# EAGLE design pcb (EAGLE 9.6.2)
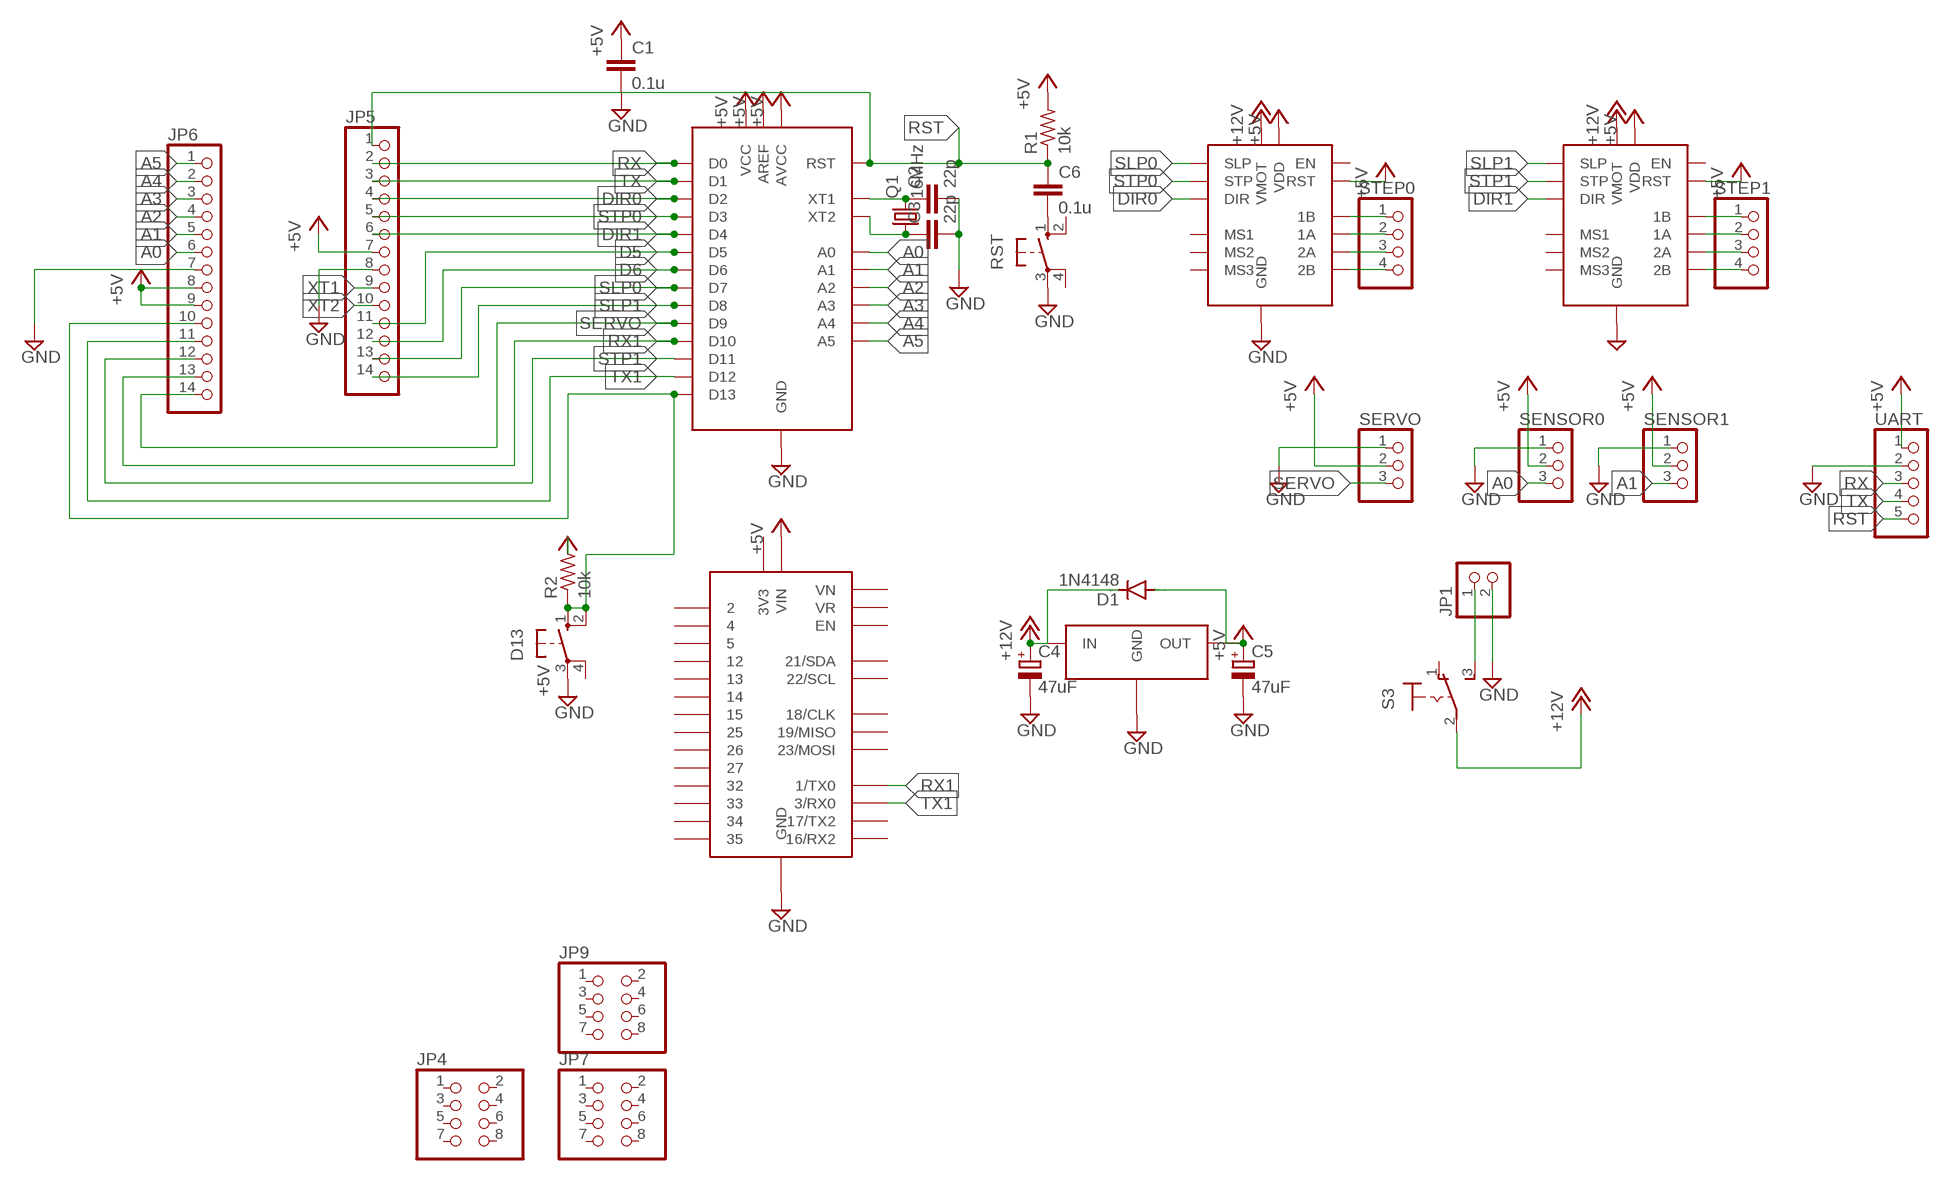
[diagram p0: schematic, sheet 1]

## Parts
C1  0.1u  C-EU025-025X050  [C025-025X050]
C2  22p  C-EU025-025X050  [C025-025X050]
C3  22p  C-EU025-025X050  [C025-025X050]
C4  47uF  CPOL-EUE2.5-5  [E2,5-5]
C5  47uF  CPOL-EUE2.5-5  [E2,5-5]
C6  0.1u  C-EU025-025X050  [C025-025X050]
D1  1N4148  [DO35-7]
D13  10-XX  [B3F-10XX]
IC1  ATMEGA328P-3  [DIL28-3]
JP1  PINHD-1X2  [1X02]
JP4  PINHD-2X4  [2X04]
JP5  PINHD-1X14  [1X14]
JP6  PINHD-1X14  [1X14]
JP7  PINHD-2X4  [2X04]
JP9  PINHD-2X4  [2X04]
Q1  16MHz  CRYSTALHC49S  [HC49/S]
R1  10k  R-US_0204/7  [0204/7]
R2  10k  R-US_0204/7  [0204/7]
RST  10-XX  [B3F-10XX]
S3  TOGGLE  [TOGGLE]
SENSOR0  PINHD-1X3  [1X03]
SENSOR1  PINHD-1X3  [1X03]
SERVO  PINHD-1X3  [1X03]
STEP0  PINHD-1X4  [1X04]
STEP1  PINHD-1X4  [1X04]
U$1  A4988  [A4988]
U$2  A4988  [A4988]
U$3  NODE32S  [NODE32S]
U$5  NJM7805  [NJM7805]
UART  PINHD-1X5  [1X05]

## Nets
+5V: C1.1 C5.+ D1.A IC1.AREF IC1.AVCC IC1.VCC JP5.7 JP6.8 JP6.9 R1.2 R2.2 SENSOR0.2 SENSOR1.2 SERVO.2 U$1.RST U$1.VDD U$2.RST U$2.VDD U$3.VIN U$5.OUT UART.1
+12V: C4.+ D1.C S3.2(P) U$1.VMOT U$2.VMOT U$5.IN
A0: IC1.A0 JP6.6 SENSOR0.3
A1: IC1.A1 JP6.5 SENSOR1.3
A2: IC1.A2 JP6.4
A3: IC1.A3 JP6.3
A4: IC1.A4 JP6.2
A5: IC1.A5 JP6.1
D5: IC1.D5 JP5.11
D6: IC1.D6 JP5.12
DIR0: IC1.D2 JP5.4 U$1.DIR
DIR1: IC1.D4 JP5.6 U$2.DIR
GND: C1.2 C2.2 C3.2 C4.- C5.- D13.3(P) IC1.GND1(GND) IC1.GND2(GND) JP1.2 JP5.8 JP6.7 RST.3(P) SENSOR0.1 SENSOR1.1 SERVO.1 U$1.GND0(GND) U$1.GND1(GND) U$2.GND0(GND) U$2.GND1(GND) U$3.GND U$3.GND1(GND) U$5.GND UART.2
N$1: STEP0.1 U$1.1B
N$2: STEP0.2 U$1.1A
N$3: STEP0.3 U$1.2A
N$4: STEP0.4 U$1.2B
N$5: C6.2 RST.1(S)
N$8: D13.1(S) D13.2(S1) IC1.D13 JP6.10 R2.1
N$9: STEP1.1 U$2.1B
N$10: STEP1.2 U$2.1A
N$11: STEP1.3 U$2.2A
N$12: STEP1.4 U$2.2B
N$13: JP1.1 S3.3(S)
RST: C6.1 IC1.RST JP5.1 R1.1 UART.5
RX: IC1.D0 JP5.2 UART.3
RX1: IC1.D10 JP6.13 U$3.TX0(1/TX0)
SERVO: IC1.D9 JP6.14 SERVO.3
SLP0: IC1.D7 JP5.13 U$1.SLP
SLP1: IC1.D8 JP5.14 U$2.SLP
STP0: IC1.D3 JP5.5 U$1.STP
STP1: IC1.D11 JP6.12 U$2.STP
TX: IC1.D1 JP5.3 UART.4
TX1: IC1.D12 JP6.11 U$3.RX0(3/RX0)
XT1: C2.1 IC1.XT1 JP5.9 Q1.2
XT2: C3.1 IC1.XT2 JP5.10 Q1.1
Unconnected: D13.4(P1) JP4.1 JP4.2 JP4.3 JP4.4 JP4.5 JP4.6 JP4.7 JP4.8 JP7.1 JP7.2 JP7.3 JP7.4 JP7.5 JP7.6 JP7.7 JP7.8 JP9.1 JP9.2 JP9.3 JP9.4 JP9.5 JP9.6 JP9.7 JP9.8 RST.2(S1) RST.4(P1) S3.1(O) U$1.EN U$1.MS1 U$1.MS2 U$1.MS3 U$2.EN U$2.MS1 U$2.MS2 U$2.MS3 U$3.2 U$3.3V3 U$3.4 U$3.5 U$3.12 U$3.13 U$3.14 U$3.15 U$3.18(18/CLK) U$3.19(19/MISO) U$3.21(21/SDA) U$3.25 U$3.26 U$3.27 U$3.32 U$3.33 U$3.34 U$3.35 U$3.D22(22/SCL) U$3.D23(23/MOSI) U$3.EN U$3.RX2(16/RX2) U$3.TX2(17/TX2) U$3.VN U$3.VR

## Library data of the parts
C1-C3 C6 = rcl:C-EU: CAPACITOR, European symbol; SPICEPREFIX: C
C4 C5 = rcl:CPOL-EU: POLARIZED CAPACITOR, European symbol; SPICEPREFIX: C
D1 = 00_Mylibrary:1N4148: DIODE high speed (Philips)
D13 RST = switch-omron:10-XX: OMRON SWITCH; MPN: B3F-1000; OC_FARNELL: 176432; OC_NEWARK: 36M3542
IC1 = 00_Mylibrary:ATMEGA328P: Dual In Line
JP1 = 00_connectors:PINHD-1X2: PIN HEADER
JP4 JP7 JP9 = 00_connectors:PINHD-2X4: PIN HEADER
JP5 JP6 = pinhead:PINHD-1X14: PIN HEADER
Q1 = crystal:CRYSTAL: CRYSTAL; OC_FARNELL: 1667008; OC_NEWARK: unknown
R1 R2 = rcl:R-US_: RESISTOR, American symbol; SPICEPREFIX: R
S3 = 00_Mylibrary:TOGGLE: TOGGLE SWITCH distributor RS Components
SENSOR0 SENSOR1 SERVO = 00_connectors:PINHD-1X3: PIN HEADER
STEP0 STEP1 = 00_connectors:PINHD-1X4: PIN HEADER
U$1 U$2 = 00_Mylibrary:A4988
U$3 = 00_Mylibrary:NODE32S
U$5 = 00_Mylibrary:NJM7805
UART = 00_connectors:PINHD-1X5: PIN HEADER

## Net classes
0 default: width 1.2 mm, clearance 0.4 mm

## Board
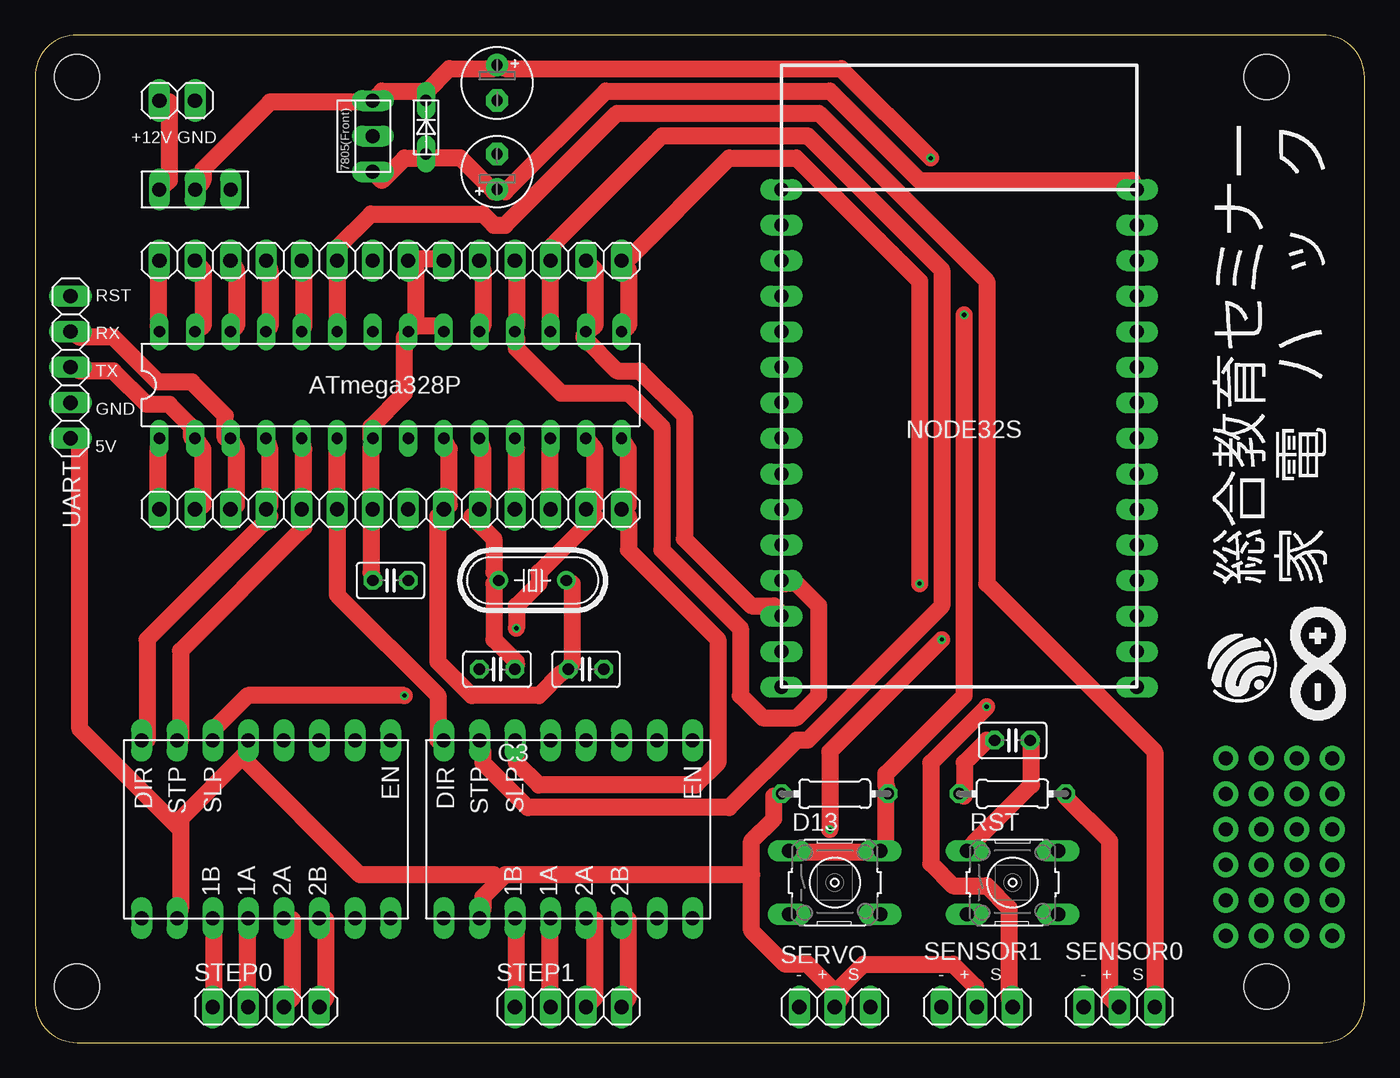
[diagram p1: board, top side]
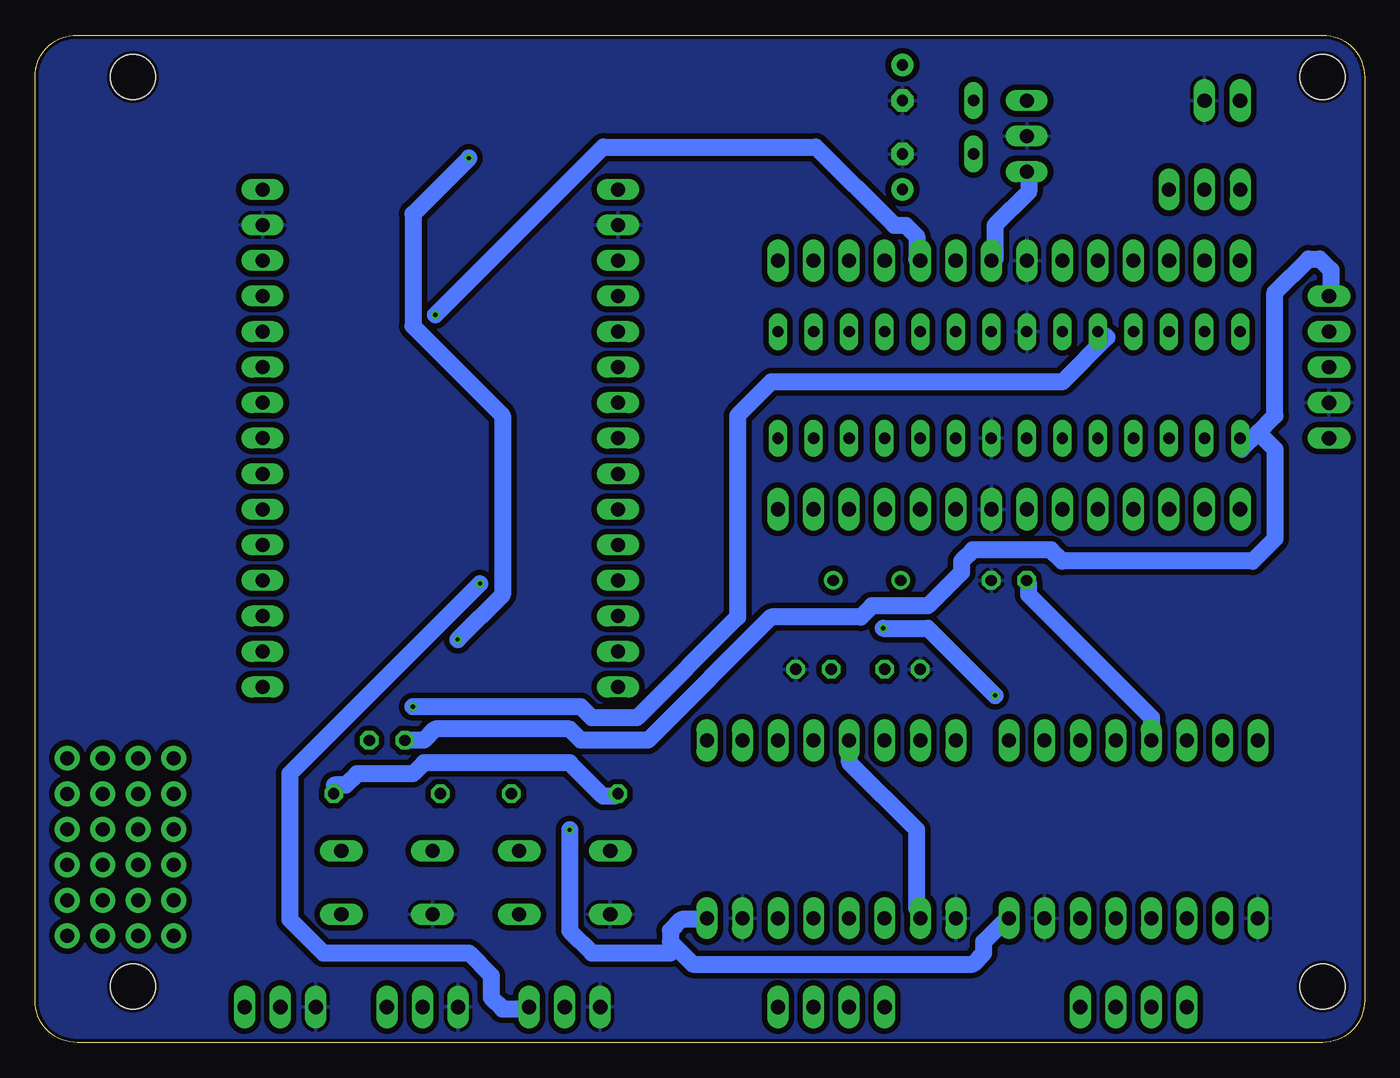
[diagram p2: board, bottom side, seen from below]

Size 95 x 72 mm. Coordinates in mm from the lower left corner, seen from the top.
Outline: 0,69 0,3 arc90 3,0 92,0 arc90 95,3 95,69 arc90 92,72 3,72 arc90 0,69
Copper layers (1*16): Top 0.035mm / dielectric 1.5mm / Bottom 0.035mm
Design rules "SeeedStudio_2layer_DRU_no_angle_20140221": minimum track width 6mil, minimum drill 12mil, track to track 6mil, track to pad 6mil, pad to pad 6mil, via to via 6mil, smd to smd 0mil, copper to edge 10mil, drill to drill 10mil, minimum pad ring 10mil, minimum via ring 6mil, stop-mask expansion 2mil, vias tented up to drill 100mil, thermal gap 10mil
Holes 3.2 mm at 3,69 3,4 88,4 88,69

### Footprints (pad centres in the part's own frame; a part is rotated, then mirrored left to right if it is on the bottom)
C025-025X050 = drill 0.813 octagon: 1 -1.27,0; 2 1.27,0
E2,5-5 = drill 0.813 pad 1.6: + -1.27,0 | drill 0.813 pad 1.6 octagon: - 1.27,0
DO35-7 = drill 0.813 long: A 3.81,0; C 0,0
B3F-10XX = drill 1.016 long: 1 -3.251,2.261; 2 3.251,2.261; 3 -3.251,-2.261; 4 3.251,-2.261
DIL28-3 = drill 0.813 long: A0 -3.81,3.81; A1 -6.35,3.81; A2 -8.89,3.81; A3 -11.43,3.81; A4 -13.97,3.81; A5 -16.51,3.81; AREF 1.27,3.81; AVCC 3.81,3.81; D0 -13.97,-3.81; D1 -11.43,-3.81; D2 -8.89,-3.81; D3 -6.35,-3.81; D4 -3.81,-3.81; D5 8.89,-3.81; D6 11.43,-3.81; D7 13.97,-3.81; D8 16.51,-3.81; D9 16.51,3.81; D10 13.97,3.81; D11 11.43,3.81; D12 8.89,3.81; D13 6.35,3.81; GND1 1.27,-3.81; GND2 -1.27,3.81; RST -16.51,-3.81; VCC -1.27,-3.81; XT1 3.81,-3.81; XT2 6.35,-3.81
1X02 = drill 1.016 long: 1 -1.27,0; 2 1.27,0
2X04 = drill 1 pad 1.778: 1 -3.81,-1.27; 2 -3.81,1.27; 3 -1.27,-1.27; 4 -1.27,1.27; 5 1.27,-1.27; 6 1.27,1.27; 7 3.81,-1.27; 8 3.81,1.27
1X14 = drill 1.016 long: 1 -16.51,0; 2 -13.97,0; 3 -11.43,0; 4 -8.89,0; 5 -6.35,0; 6 -3.81,0; 7 -1.27,0; 8 1.27,0; 9 3.81,0; 10 6.35,0; 11 8.89,0; 12 11.43,0; 13 13.97,0; 14 16.51,0
HC49/S = drill 0.813: 1 -2.413,0; 2 2.413,0
0204/7 = drill 0.813 octagon: 1 -3.81,0; 2 3.81,0
TOGGLE = drill 1 long: 1 0,2.54; 2 0,0; 3 0,-2.54
1X03 = drill 1.016 long: 1 -2.54,0; 2 0,0; 3 2.54,0
1X04 = drill 1.016 long: 1 -3.81,0; 2 -1.27,0; 3 1.27,0; 4 3.81,0
A4988 = drill 1 long: 1A 6.35,-1.27; 1B 6.35,-3.81; 2A 6.35,1.27; 2B 6.35,3.81; DIR -6.35,-8.89; EN -6.35,8.89; GND0 6.35,-8.89; GND1 6.35,6.35; MS1 -6.35,6.35; MS2 -6.35,3.81; MS3 -6.35,1.27; RST -6.35,-1.27; SLP -6.35,-3.81; STP -6.35,-6.35; VDD 6.35,-6.35; VMOT 6.35,8.89
NODE32S = drill 1 long: 2 -12.7,10.16; 3V3 -12.7,17.78; 4 -12.7,7.62; 5 -12.7,0; 12 12.7,10.16; 13 12.7,12.7; 14 12.7,7.62; 15 -12.7,12.7; 18 -12.7,-2.54; 19 -12.7,-5.08; 21 -12.7,-7.62; 25 12.7,0; 26 12.7,2.54; 27 12.7,5.08; 32 12.7,-5.08; 33 12.7,-2.54; 34 12.7,-10.16; 35 12.7,-7.62; D22 -12.7,-15.24; D23 -12.7,-17.78; EN 12.7,-17.78; GND -12.7,15.24; GND1 12.7,15.24; RX0 -12.7,-10.16; RX2 -12.7,5.08; TX0 -12.7,-12.7; TX2 -12.7,2.54; VIN 12.7,17.78; VN 12.7,-12.7; VR 12.7,-15.24
NJM7805 = drill 1 long: GND 0,0; IN -2.54,0; OUT 2.54,0
1X05 = drill 1.016 long: 1 -5.08,0; 2 -2.54,0; 3 0,0; 4 2.54,0; 5 5.08,0

### Placement (x,y rotation side)
C1  25.4,33.02 0 top
C2  39.37,26.67 0 top
C3  33.02,26.67 180 top
C4  33.02,68.58 270 top
C5  33.02,62.23 90 top
C6  69.85,21.59 0 top
D1  27.94,67.31 270 top
D13  57.15,11.43 0 top
IC1  25.4,46.99 0 top
JP1  10.16,67.31 0 top
JP4  88.9,19.05 0 top
JP5  25.4,38.1 0 top
JP6  25.4,55.88 0 top
JP7  88.9,13.97 0 top
JP9  88.9,8.89 0 top
Q1  35.56,33.02 0 top
R1  69.85,17.78 0 top
R2  57.15,17.78 180 top
RST  69.85,11.43 0 top
S3  11.43,60.96 270 top
SENSOR0  77.47,2.54 0 top
SENSOR1  67.31,2.54 0 top
SERVO  57.15,2.54 0 top
STEP0  16.51,2.54 0 top
STEP1  38.1,2.54 0 top
U$1  16.51,15.24 270 top
U$2  38.1,15.24 270 top
U$3  66.04,43.18 0 top
U$5  24.13,64.77 270 top
UART  2.54,48.26 90 top

### Tracks (layer width: path | path; a pad name or v marks a point on that pad's centre or on a via)
+5V
  Top 1.2: 27.2,51.2 28.8,51.2 IC1.AVCC | JP6.9 28.8,56 27.2,56 JP6.8 27.2,55.2 27.2,51.2 | 27.2,51.2 IC1.AREF 26.4,50.4 26.4,46.4 24,44 24,43.2 IC1.VCC 24,42.4 24,38.4 JP5.7 24,37.6 24,33.6 C1.1 | 28,63.2 26.4,63.2 24.8,61.6 U$5.OUT | U$3.VIN 78.4,61.6 63.2,61.6 56.8,68 40.8,68 33.6,60.8 C5.+ 32.8,60.8 30.4,63.2 28,63.2 | 28,63.2 D1.A | 10.4,15.2 10.4,16 14.8,20.4 | 10.4,15.2 10.4,9.6 U$1.VDD | 14.8,20.4 15.2,20.8 U$1.RST | 10.4,15.2 3.2,22.4 3.2,43.2 UART.1 | R1.2 73.6,17.6 76.8,14.4 76.8,3.2 SENSOR0.2 | 51.2,12 51.2,8 53.6,5.6 55.2,5.6 57.2,3.6 | 51.2,12 51.2,14.4 52.8,16 52.8,17.6 R2.2 | 57.2,3.6 57.6,3.2 SERVO.2 | 33.2,11.6 33.6,12 51.2,12 | 33.2,11.6 32,10.4 32,9.6 U$2.VDD | 57.2,3.6 59.2,5.6 65.6,5.6 67.2,4 67.2,3.2 SENSOR1.2 | 14.8,20.4 23.2,12 32.8,12 33.2,11.6
  Bottom 1.2: JP6.8 26.4,56 26.4,58.4 24,60.8 24,61.6 U$5.OUT | U$2.RST 36.8,20.8 36.8,20 32,15.2 32,9.6 U$2.VDD | R1.2 73.6,18.4 72.8,18.4 72,19.2 68,19.2 67.2,20 56.8,20 54.4,17.6 53.6,17.6 R2.2 | C1.1 24,32.8 24,32 15.2,23.2 15.2,21.6 U$1.RST
+12V  (via drill 0.3)
  Top 1.2: 28,68 24.8,68 U$5.IN 24,67.2 16.8,67.2 12,62.4 12,61.6 S3.2 | 28,68 29.6,69.6 32.8,69.6 C4.+ 33.6,69.6 57.6,69.6 v64,63.2 | 28,68 D1.C | v56.8,15.2 56.8,20.8 v64.8,28.8
  Bottom 1.2: 49.2,6.8 49.6,7.2 49.6,8 48.8,8.8 47.2,8.8 U$2.VMOT | 49.2,6.8 48,5.6 28,5.6 27.2,6.4 27.2,7.2 25.6,8.8 U$1.VMOT | v56.8,15.2 56.8,8 55.2,6.4 49.6,6.4 49.2,6.8 | v64.8,28.8 61.6,32 61.6,44.8 68,51.2 68,59.2 v64,63.2
A0
  Top 1.2: IC1.A0 21.6,51.2 21.6,55.2 JP6.6 21.6,56 21.6,56.8 24,59.2 32,59.2 32.8,58.4 33.6,58.4 41.6,66.4 56,66.4 68,54.4 68,32.8 80,20.8 80,3.2 SENSOR0.3
A1  (via drill 0.3)
  Top 1.2: IC1.A1 19.2,51.2 19.2,55.2 JP6.5 | v68,24 64,20 64,12.8 65.6,11.2 68,11.2 69.6,9.6 69.6,3.2 SENSOR1.3
  Bottom 1.2: v68,24 56,24 55.2,23.2 52,23.2 44.8,30.4 44.8,44.8 42.4,47.2 21.6,47.2 18.4,50.4 IC1.A1
A2
  Top 1.2: IC1.A2 16.8,51.2 16.8,55.2 JP6.4
A3
  Top 1.2: IC1.A3 14.4,51.2 14.4,55.2 JP6.3
A4
  Top 1.2: IC1.A4 12,51.2 12,55.2 JP6.2
A5
  Top 1.2: IC1.A5 8.8,51.2 8.8,55.2 JP6.1
D5
  Top 1.2: IC1.D5 34.4,42.4 34.4,38.4 JP5.11
D6
  Top 1.2: IC1.D6 36.8,42.4 36.8,38.4 JP5.12
DIR0
  Top 1.2: IC1.D2 16.8,42.4 16.8,38.4 JP5.4 16.8,37.6 8,28.8 8,21.6 U$1.DIR
DIR1
  Top 1.2: IC1.D4 21.6,42.4 21.6,38.4 JP5.6 21.6,37.6 21.6,32 28.8,24.8 28.8,21.6 U$2.DIR
GND
  pour Bottom: -10.16,71.12 -10.16,-10.16 111.76,-10.16 111.76,81.28 -10.16,81.28
N$1
  Top 1.2: U$1.1B 12.8,8.8 12.8,3.2 STEP0.1
N$2
  Top 1.2: U$1.1A 15.2,8.8 15.2,3.2 STEP0.2
N$3
  Top 1.2: U$1.2A 18.4,8.8 18.4,3.2 STEP0.3
N$4
  Top 1.2: U$1.2B 20.8,8.8 20.8,3.2 STEP0.4
N$5
  Top 1.2: C6.2 71.2,21.6 71.2,18.4 67.2,14.4 RST.1
N$8  (via drill 0.3)
  Top 1.2: IC1.D13 32,51.2 32,55.2 JP6.10 | D13.1 54.4,13.6 60,13.6 D13.2 60.8,14.4 60.8,17.6 R2.1 60.8,18.4 60.8,19.2 66.4,24.8 v66.4,52
  Bottom 1.2: v66.4,52 54.4,64 39.2,64 33.6,58.4 32.8,58.4 32,57.6 32,56 JP6.10
N$9
  Top 1.2: U$2.1B 34.4,8.8 34.4,3.2 STEP1.1
N$10
  Top 1.2: U$2.1A 36.8,8.8 36.8,3.2 STEP1.2
N$11
  Top 1.2: U$2.2A 40,8.8 40,3.2 STEP1.3
N$12
  Top 1.2: U$2.2B 42.4,8.8 42.4,3.2 STEP1.4
N$13
  Top 1.2: S3.3 9.6,61.6 9.6,67.2 JP1.1
RST
  Top 1.2: R1.1 66.4,17.6 66.4,20 68,21.6 C6.1 | IC1.RST 8.8,42.4 8.8,38.4 JP5.1
  Bottom 1.2: 7.6,43.6 8.8,42.4 IC1.RST | 7.6,43.6 6.4,44.8 6.4,53.6 4,56 3.2,56 2.4,55.2 2.4,53.6 UART.5 | 7.6,43.6 6.4,42.4 6.4,36 8,34.4 21.6,34.4 22.4,35.2 28,35.2 28.8,34.4 28.8,33.6 31.2,31.2 35.2,31.2 36,30.4 42.4,30.4 51.2,21.6 56,21.6 56.8,22.4 66.4,22.4 67.2,21.6 68,21.6 C6.1
RX
  Top 1.2: JP5.2 12,38.4 12,42.4 IC1.D0 11.2,43.2 11.2,44 9.6,45.6 8,45.6 5.6,48 3.2,48 UART.3
RX1
  Top 1.2: JP6.13 40,55.2 40,51.2 IC1.D10 39.2,50.4 41.6,48 43.2,48 46.4,44.8 46.4,36 51.2,31.2 52.8,31.2 U$3.TX0
SERVO  (via drill 0.3)
  Top 1.2: IC1.D9 42.4,51.2 42.4,55.2 JP6.14 42.4,56 49.6,63.2 54.4,63.2 63.2,54.4 v63.2,32.8
  Bottom 1.2: v63.2,32.8 76.8,19.2 76.8,8.8 74.4,6.4 64,6.4 62.4,4.8 62.4,3.2 61.6,2.4 60,2.4 SERVO.3
SLP0  (via drill 0.3)
  Top 1.2: IC1.D7 40,42.4 40,38.4 JP5.13 40,37.6 36,33.6 36,32.8 34.4,31.2 v34.4,29.6 | v26.4,24.8 15.2,24.8 12.8,22.4 12.8,21.6 U$1.SLP
  Bottom 1.2: v26.4,24.8 31.2,29.6 v34.4,29.6
SLP1
  Top 1.2: IC1.D8 42.4,42.4 42.4,38.4 JP5.14 42.4,37.6 42.4,35.2 48.8,28.8 48.8,20 47.2,18.4 36,18.4 34.4,20 34.4,20.8 U$2.SLP
STP0
  Top 1.2: IC1.D3 19.2,42.4 19.2,38.4 JP5.5 19.2,37.6 19.2,36.8 10.4,28 10.4,21.6 U$1.STP
STP1
  Top 1.2: IC1.D11 36.8,51.2 36.8,55.2 JP6.12 36.8,56 36.8,56.8 44.8,64.8 55.2,64.8 64.8,55.2 64.8,31.2 55.2,21.6 54.4,21.6 49.6,16.8 35.2,16.8 32,20 32,20.8 U$2.STP
TX
  Top 1.2: JP5.3 14.4,38.4 14.4,42.4 IC1.D1 13.6,43.2 13.6,44.8 11.2,47.2 8.8,47.2 5.6,50.4 3.2,50.4 UART.4
TX1
  Top 1.2: JP6.11 34.4,55.2 34.4,51.2 IC1.D12 34.4,50.4 34.4,49.6 37.6,46.4 42.4,46.4 44.8,44 44.8,35.2 50.4,29.6 50.4,24.8 52,23.2 54.4,23.2 56,24.8 56,31.2 54.4,32.8 53.6,32.8 U$3.RX0
XT1
  Top 1.2: IC1.XT1 29.6,42.4 29.6,38.4 JP5.9 28.8,37.6 28.8,27.2 31.2,24.8 36,24.8 37.6,26.4 C2.1 38.4,27.2 38.4,32.8 Q1.2
XT2
  Top 1.2: IC1.XT2 32,42.4 32,38.4 JP5.10 31.2,37.6 32.8,36 32.8,33.6 Q1.1 32.8,32.8 32.8,28.8 34.4,27.2 C3.1

### Text on the board
tNames: +12V GND | RST / / RX / / TX / / GND / / 5V | - + S | - + S | - + S